# Altium schematic sheet Interface.SchDoc
size A4
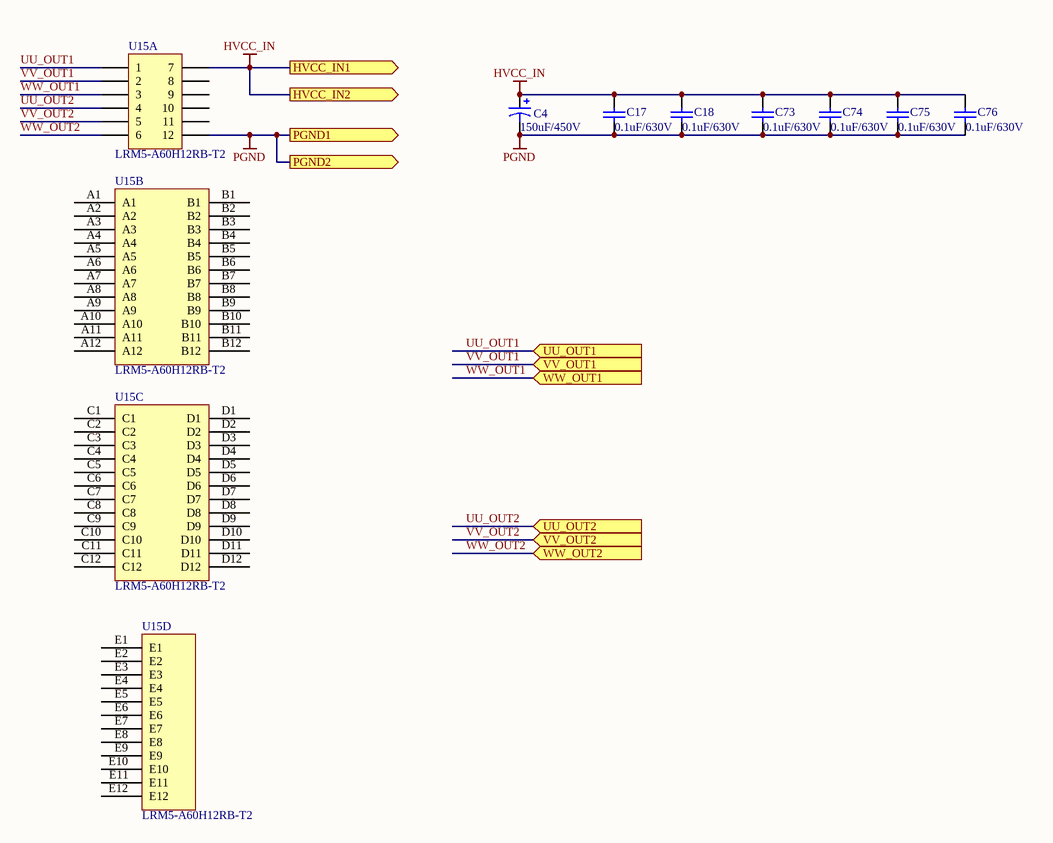
[diagram p0: Interface.SchDoc]

## Parts
C4  150uF/450V  [MKP3D-450V-140UF-1]
C17  0.1uF/630V  [WP_1812]
C18  0.1uF/630V  [WP_1812]
C73  0.1uF/630V  [WP_1812]
C74  0.1uF/630V  [WP_1812]
C75  0.1uF/630V  [WP_1812]
C76  0.1uF/630V  [WP_1812]
U15  LRM5-A60H12RB-T2  [WP_LRM5-A60H12RB-T2]  (parts A,B,C,D of 4)

## Ports
HVCC_IN1 (out), HVCC_IN2 (out), PGND1 (out), PGND2 (out), UU_OUT1 (in), UU_OUT2 (in), VV_OUT1 (in), VV_OUT2 (in), WW_OUT1 (in), WW_OUT2 (in)

## Nets
HVCC_IN: C4.1 C17.2 C18.2 C73.2 C74.2 C75.2 C76.2 U15.7 ; port HVCC_IN1, port HVCC_IN2
PGND: C4.2 C17.1 C18.1 C73.1 C74.1 C75.1 C76.1 U15.12 ; port PGND1, port PGND2
UU_OUT1: U15.1 ; port UU_OUT1
UU_OUT2: U15.4 ; port UU_OUT2
VV_OUT1: U15.2 ; port VV_OUT1
VV_OUT2: U15.5 ; port VV_OUT2
WW_OUT1: U15.3 ; port WW_OUT1
WW_OUT2: U15.6 ; port WW_OUT2

Not connected (* = marked no-connect by the designer): U15 8 9 10 11 A1 A2 A3 A4 A5 A6 A7 A8 A9 A10 A11 A12 B1 B2 B3 B4 B5 B6 B7 B8 B9 B10 B11 B12 C1 C2 C3 C4 C5 C6 C7 C8 C9 C10 C11 C12 D1 D2 D3 D4 D5 D6 D7 D8 D9 D10 D11 D12 E1 E2 E3 E4 E5 E6 E7 E8 E9 E10 E11 E12

## Library data of the parts
C4 = Cap Pol1: Polarized Capacitor (Radial); Value: 220uF/250V; Published: 8-Jun-2000; LatestRevisionDate: 17-Jul-2002; LatestRevisionNote: Re-released for DXP Platform.; PackageReference: RB7.6-15; Publisher: Altium Limited; PackageDescription: Polarized Capacitor (Radial); 2 Leads
C17 C18 C73-C76 = Cap Semi: Capacitor (Semiconductor SIM Model); Value: 1uF/250V; Published: 8-Jun-2000; LatestRevisionDate: 29-May-2009; LatestRevisionNote: IPC-7351 Footprint Added.; PackageReference: C1206; Publisher: Altium Limited; PackageDescription: Chip Capacitor
U15 = MULTI_HEADER